# EasyEDA Pro project AmpBoard64TP.eprj, board Mod8TP
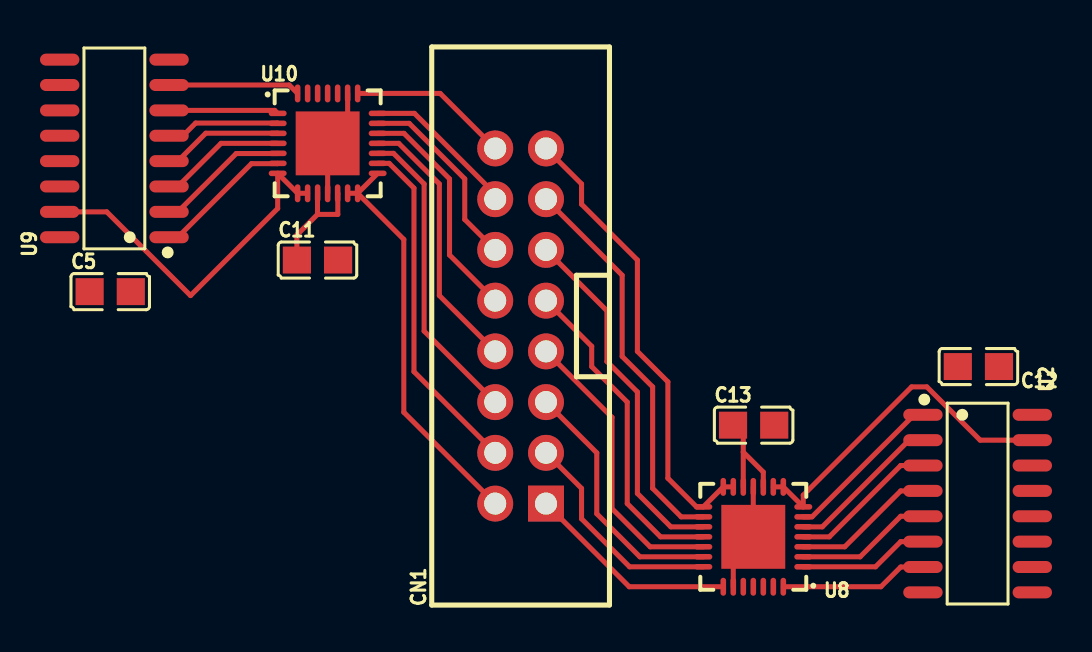
[diagram p5: board, top side]
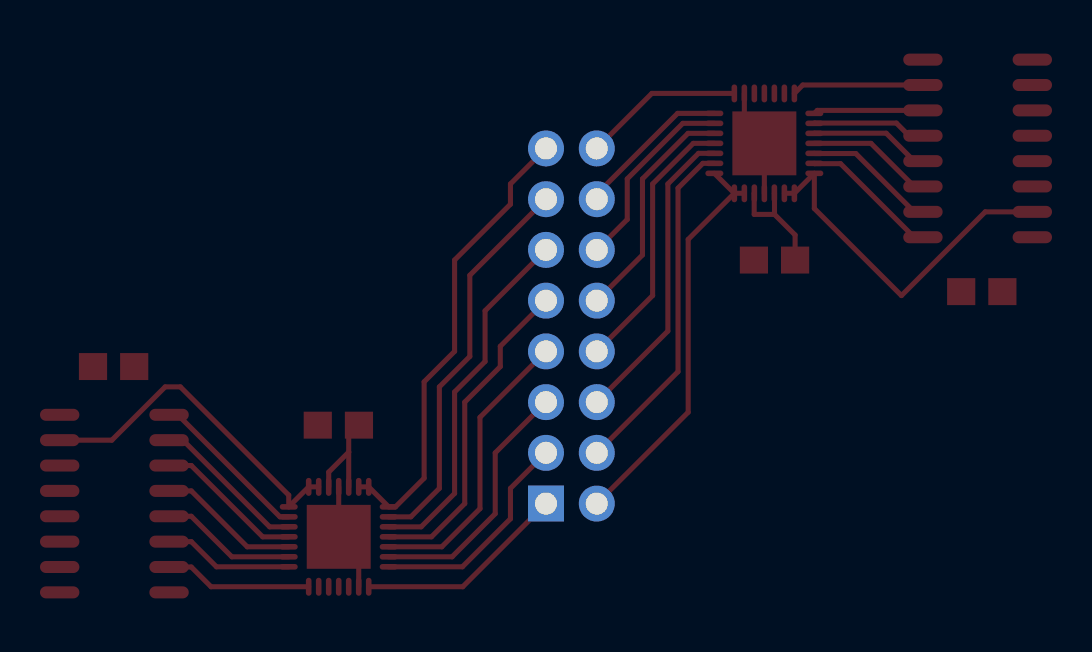
[diagram p6: board, bottom side, seen from below]

No outline. copper layers: Top Layer, Bottom Layer. Coordinates in mm from the lowest, leftmost part position.
Stack: Top Layer 0.035mm / Dielectric1 1.51mm FR4 er 4.5 / Bottom Layer 0.035mm

## Design rules (mm)
template: JLCPCB Capability(Two Layers Board)
spacing copperThickness1oz (default): track to track 0.102, other pairs 0.152 to 0.3
spacing copperThickness2oz: track to track 0.203, other pairs 0.152 to 0.3
track width copperThickness1oz (default): min 0.127, default 0.254, max 2.54
track width copperThickness2oz: min 0.203, default 0.254, max 2.54
differential pair differentialPair (default): width min 0.127, default 0.254, max 2.54; gap min 0.152, default 0.152
via viaSize (default): diameter min 0.5, default 0.61, max 10; hole min 0.3, default 0.305, max 6.3

## Placement (name value [footprint] x y rotation side)
C5  100pF  [C0805]  0 12.27 0 top
C11  100pF  [C0805]  10.37 13.86 0 top
C12  100pF  [C0805]  43.43 8.52 180 top
C13  100pF  [C0805]  32.18 5.59 0 top
CN1  KH-2.54PH180-2X8P-L8.9  [CONN-TH_16P-P2.54_KINGHELM_KH-2.54PH180-2X8P-L8.9]  20.53 10.55 90 top
U2  74HC595D,118  [SOIC-16_L9.9-W3.9-P1.27-LS6.0-BL]  43.39 1.66 270 top
U8  TPS65190RHDR  [VQFN-28_L5.0-W5.0-P0.50-TL-EP3.2]  32.17 0 180 top
U9  74HC595D,118  [SOIC-16_L9.9-W3.9-P1.27-LS6.0-BL]  0.21 19.44 90 top
U10  TPS65190RHDR  [VQFN-28_L5.0-W5.0-P0.50-TL-EP3.2]  10.88 19.7 0 top

## Footprints (pads in the part's own frame, mm; a bottom-side part is the same pattern mirrored in y, then rotated)
C0805
  rect 1.41x1.35 smd: 1(-1.03,0) 2(1.03,0)
CONN-TH_16P-P2.54_KINGHELM_KH-2.54PH180-2X8P-L8.9
  rect 1.8x1.8 hole 1.1: 1(-8.89,-1.27)
  round 1.8 hole 1.1: 2(-8.89,1.27) 3(-6.35,-1.27) 4(-6.35,1.27) 5(-3.81,-1.27) 6(-3.81,1.27) 7(-1.27,-1.27) 8(-1.27,1.27) 9(1.27,-1.27) 10(1.27,1.27) 11(3.81,-1.27) 12(3.81,1.27) 13(6.35,-1.27) 14(6.35,1.27) 15(8.89,-1.27) 16(8.89,1.27)
SOIC-16_L9.9-W3.9-P1.27-LS6.0-BL
  oval 0.602x1.971 smd: 1(-4.445,-2.736) 2(-3.175,-2.736) 3(-1.905,-2.736) 4(-0.635,-2.736) 5(0.635,-2.736) 6(1.905,-2.736) 7(3.175,-2.736) 8(4.445,-2.736) 9(4.445,2.736) 10(3.175,2.736) 11(1.905,2.736) 12(0.635,2.736) 13(-0.635,2.736) 14(-1.905,2.736) 15(-3.175,2.736) 16(-4.445,2.736)
VQFN-28_L5.0-W5.0-P0.50-TL-EP3.2
  oval 0.9x0.28 smd: 1(-2.5,1.502) 2(-2.5,1.001) 3(-2.5,0.5) 4(-2.5,0) 5(-2.5,-0.5) 6(-2.5,-1) 7(-2.5,-1.501) 15(2.5,-1.501) 16(2.5,-1) 17(2.5,-0.5) 18(2.5,0) 19(2.5,0.5) 20(2.5,1.001) 21(2.5,1.502)
  oval 0.28x0.9 smd: 8(-1.502,-2.5) 9(-1.001,-2.5) 10(-0.5,-2.5) 11(0,-2.5) 12(0.5,-2.5) 13(1,-2.5) 14(1.501,-2.5) 22(1.501,2.5) 23(1,2.5) 24(0.5,2.5) 25(0,2.5) 26(-0.5,2.5) 27(-1.001,2.5) 28(-1.502,2.5)
  rect 3.2x3.2 smd: 29(0,0)

## Nets
As in the schematic.

Pads without a net: U2 9; U8 24 25 26 27; U9 9; U10 24 25 26 27

## Routing (per net, layer and track width the routed paths; a pad name or vN(x,y) marks a point on that pad's centre or on a via; arc(x,y) is an arc through that point)
GND: length 10.8
  Top Layer w0.254: U8.23 31.17,-1.41 32.17,-0.41 U8.29 U8.11 ; U10.11 U10.29 11.88,20.7 U10.23
VCC: length 11.3
  Top Layer w0.254: U8.10 32.67,3.24 31.67,4.24 ; 31.67,4.24 31.67,5.08 C13.1 ; 31.67,4.24 U8.12 ; C11.1 9.34,15.11 10.37,16.14 ; 10.37,16.14 10.37,17.19 U10.10 ; 10.37,16.14 11.38,16.14 11.38,17.19 U10.12
$1N787: length 19.8
  Top Layer w0.254: CN1.13 25.61,13.09 25.61,9.03 27.13,7.51 27.13,2.43 28.56,1 U8.16
$1N791: length 18.1
  Top Layer w0.254: U8.17 28.04,0.5 26.37,2.17 26.37,7.25 24.85,8.78 24.85,11.32 CN1.11
$1N795: length 16.3
  Top Layer w0.254: CN1.9 24.08,9.54 24.08,8.52 25.86,6.74 25.86,1.66 27.53,0 U8.18
$1N799: length 14.6
  Top Layer w0.254: CN1.7 25.1,5.98 25.1,1.41 27.01,-0.5 U8.19
$1N803: length 12.9
  Top Layer w0.254: U8.20 26.5,-1 24.34,1.16 24.34,4.2 CN1.5
$1N807: length 11.1
  Top Layer w0.254: U8.21 25.98,-1.5 23.58,0.9 23.58,2.43 CN1.3
$1N811: length 10.6
  Top Layer w0.254: CN1.1 25.96,-2.5 U8.22
$1N815: length 23.3
  Top Layer w0.254: CN1.15 23.58,17.67 23.58,16.65 26.37,13.86 26.37,9.28 27.89,7.76 27.89,2.93 29.33,1.5 U8.15 U8.14 U8.13
$1N826: length 17.3
  Top Layer w0.254: 33.17,2.5 U8.8 U8.7 34.67,2.09 40.09,7.51 40.85,7.51 43.51,4.84 U2.15
$1N837: length 8.1
  Top Layer w0.254: U8.6 35.1,1 40.21,6.11 40.65,6.11
$1N841: length 7.8
  Top Layer w0.254: U8.5 35.62,0.5 39.96,4.84 U2.2
$1N845: length 7.5
  Top Layer w0.254: U2.3 39.54,3.57 35.97,0 U8.4
$1N849: length 7.1
  Top Layer w0.254: U8.3 36.74,-0.5 39.54,2.3 40.65,2.3
$1N853: length 6.8
  Top Layer w0.254: U8.2 37.51,-1 39.54,1.03 U2.5
$1N857: length 6.5
  Top Layer w0.254: U8.1 38.28,-1.5 39.54,-0.24 40.65,-0.24
$1N861: length 7.4
  Top Layer w0.254: U8.28 38.55,-2.5 39.54,-1.51 U2.7
$1N888: length 17.3
  Top Layer w0.254: U10.16 13.95,18.7 15.19,17.46 15.19,8.27 CN1.4
$1N892: length 15.4
  Top Layer w0.254: U10.17 14.17,19.2 15.7,17.67 15.7,10.3 CN1.6
$1N896: length 13.5
  Top Layer w0.254: CN1.8 16.46,12.08 16.46,17.67 14.43,19.7 U10.18
$1N900: length 11.6
  Top Layer w0.254: U10.19 14.69,20.2 16.97,17.92 16.97,14.11 CN1.10
$1N904: length 9.7
  Top Layer w0.254: U10.20 14.95,20.7 17.73,17.92 17.73,15.89 CN1.12
$1N908: length 7.8
  Top Layer w0.254: CN1.14 19.26,17.16 15.22,21.2 U10.21
$1N912: length 8
  Top Layer w0.254: CN1.16 16.5,22.2 U10.22
$1N916: length 20.3
  Top Layer w0.254: U10.13 U10.14 ; U10.14 U10.15 ; U10.14 14.69,14.89 14.69,6.24 CN1.2
$1N927: length 18.1
  Top Layer w0.254: U9.15 -0.17,16.27 4.02,12.08 8.38,16.44 U10.7 U10.8 U10.9
$1N938: length 7
  Top Layer w0.254: U9.1 3.38,15 7.07,18.68 8.36,18.68 U10.6
$1N942: length 6.6
  Top Layer w0.254: U10.5 8.37,19.19 6.3,19.19 3.38,16.27 U9.2
$1N946: length 6.3
  Top Layer w0.254: U9.3 3.38,17.54 5.54,19.7 U10.4
$1N950: length 6
  Top Layer w0.254: U9.4 3.38,18.81 4.78,20.21 8.37,20.21 U10.3
$1N954: length 5.7
  Top Layer w0.254: U9.5 3.64,20.08 4.27,20.71 8.36,20.71 U10.2
$1N958: length 5.5
  Top Layer w0.254: U10.1 8.23,21.35 U9.6
$1N962: length 6.6
  Top Layer w0.254: U10.28 8.95,22.62 U9.7
